# Altium project QUTMS_SteeringWheel.PrjPcb
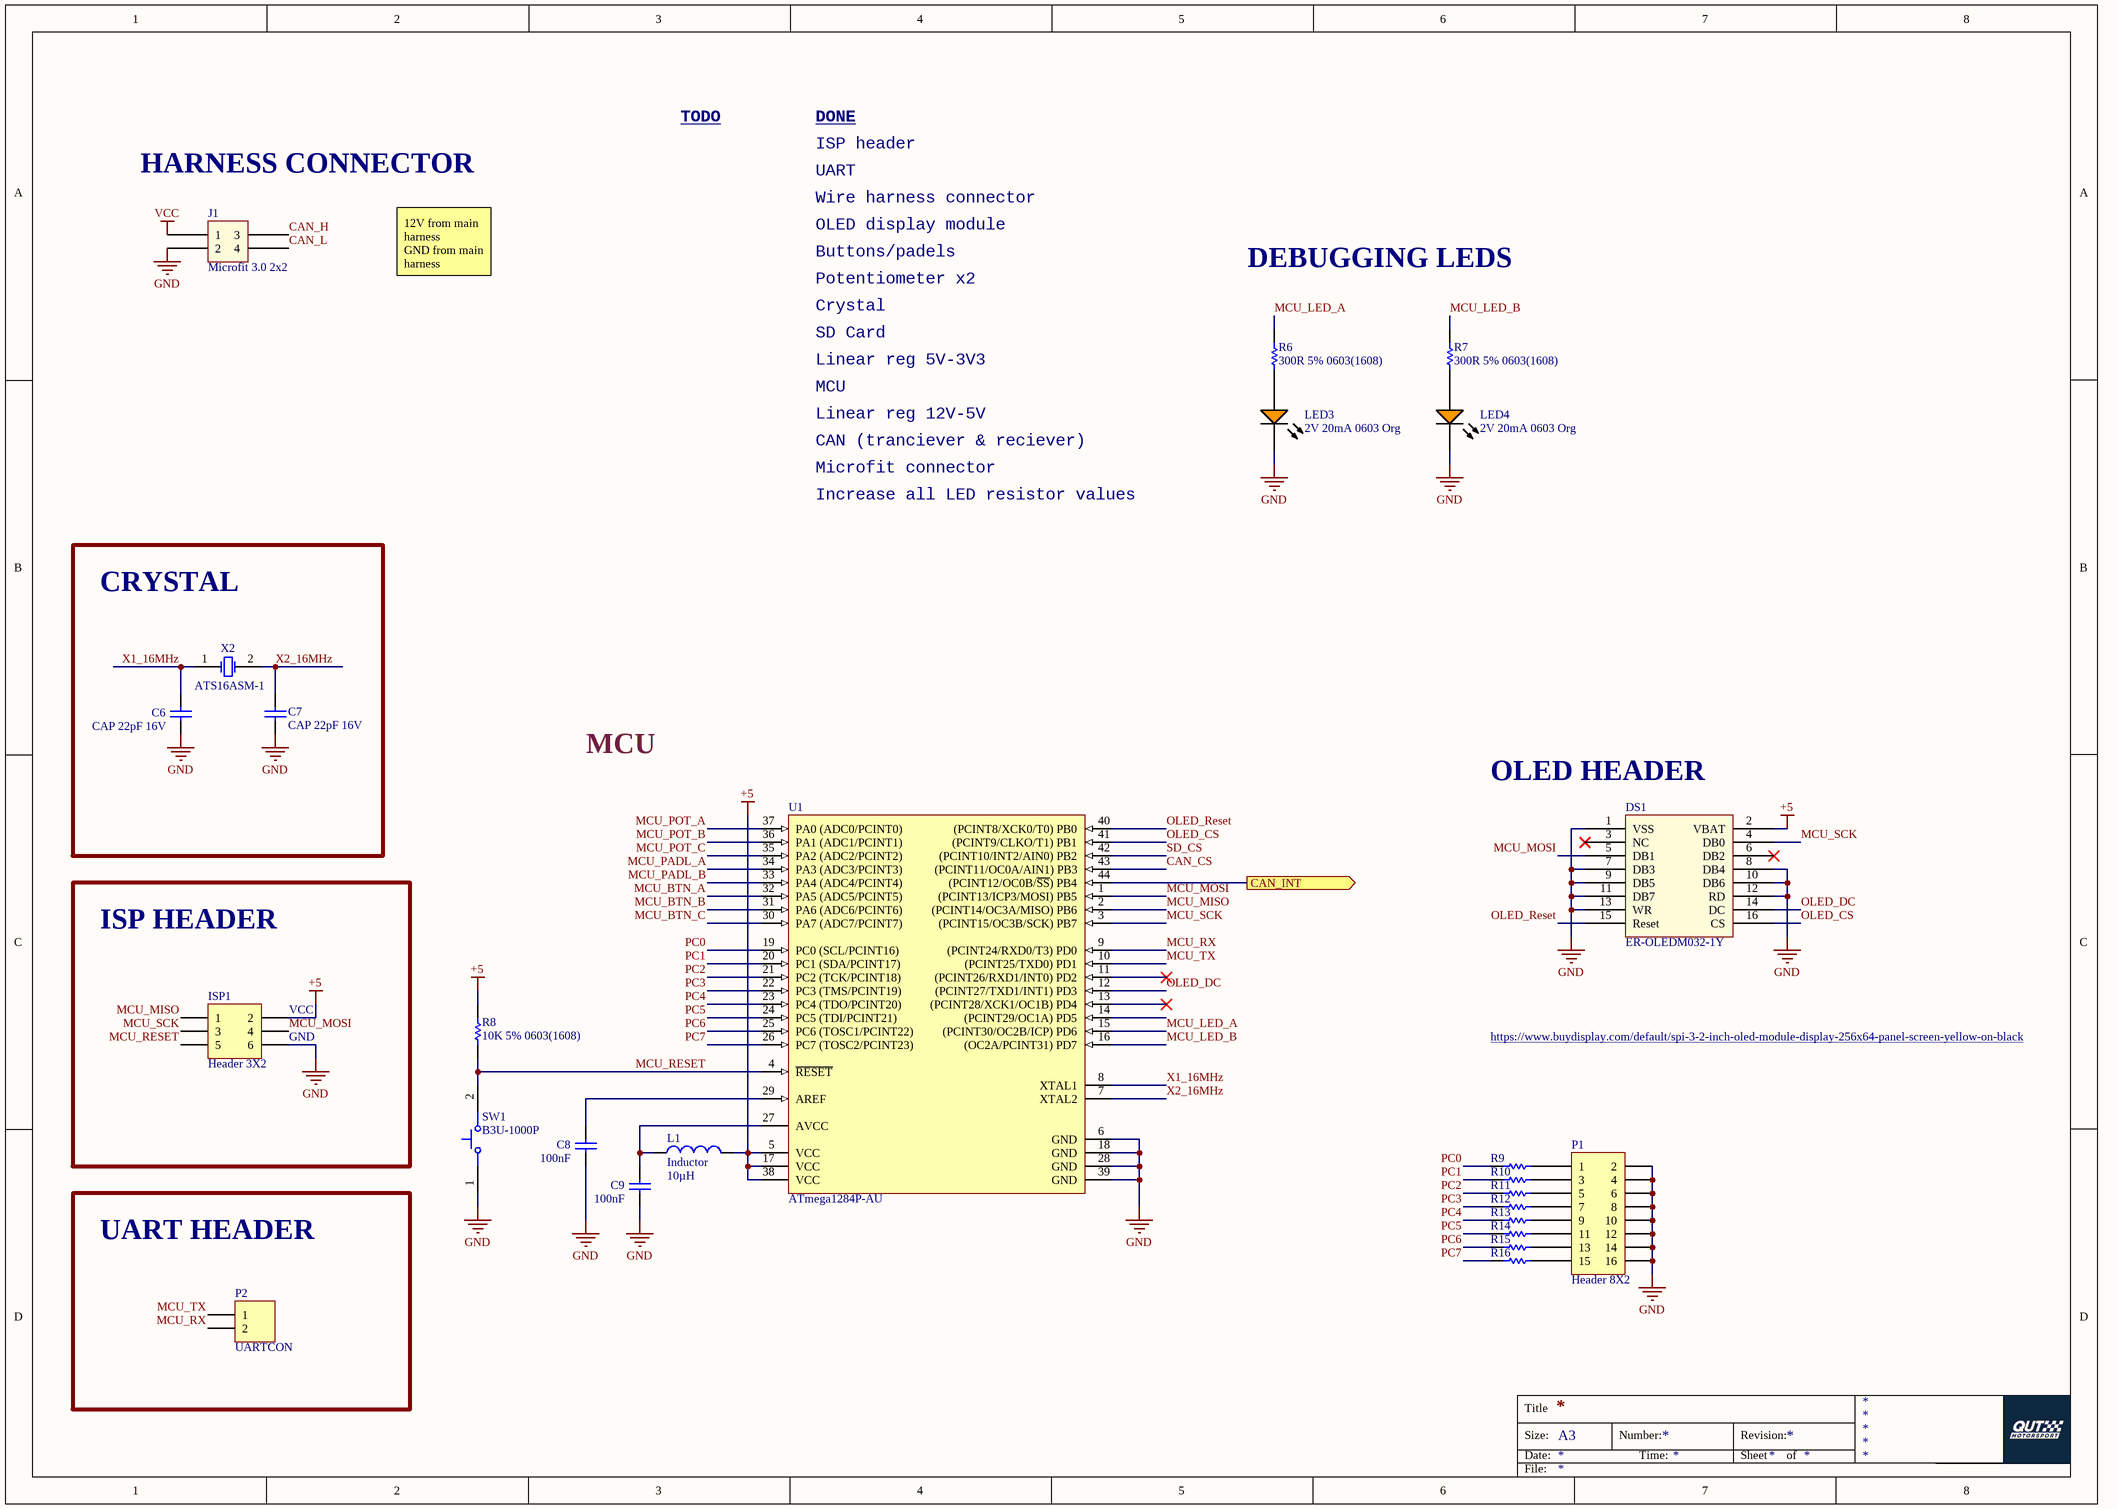
[diagram p0: Control.SchDoc]
5 sheets, 64 parts. Net scope: flat (ports and power ports of the same name join across sheets).
Board file: Board.PcbDoc
Sheets:
  Control.SchDoc
  CAN.SchDoc
  SDCard.SchDoc
  Linear Regulator.SchDoc
  Input.SchDoc

## Sheet Control.SchDoc
size A3

### Parts
C6  CAP 22pF 16V  [CAPC0603(1608)100_N]
C7  CAP 22pF 16V  [CAPC0603(1608)100_N]
C8  100nF  [CAPC0603(1608)100_M]
C9  100nF  [CAPC0603(1608)100_M]
DS1  ER-OLEDM032-1Y  [ER-OLEDM032-1Y]
ISP1  Header 3X2  [HDR2X3]
J1  Microfit 3.0 2x2  [Microfit_2X2_R_TH]
L1  Inductor  value 10µH  [0603]
LED3  2V 20mA 0603 Org  [KING-LED0603-25-ORANGE_V]
LED4  2V 20mA 0603 Org  [KING-LED0603-25-ORANGE_V]
P1  Header 8X2  [HDR2X8]
P2  UARTCON  [HDR1X2]
R6  300R 5% 0603(1608)  [RESC0603(1608)_N]
R7  300R 5% 0603(1608)  [RESC0603(1608)_N]
R8  10K 5% 0603(1608)  [RESC0603(1608)_N]
R9  JMP  [RESC0603(1608)_N]  (value not drawn)
R10  JMP  [RESC0603(1608)_N]  (value not drawn)
R11  JMP  [RESC0603(1608)_N]  (value not drawn)
R12  JMP  [RESC0603(1608)_N]  (value not drawn)
R13  JMP  [RESC0603(1608)_N]  (value not drawn)
R14  JMP  [RESC0603(1608)_N]  (value not drawn)
R15  JMP  [RESC0603(1608)_N]  (value not drawn)
R16  (no value)  [RESC0603(1608)_N]
SW1  B3U-1000P  [OMRON-B3U-1000_V]
U1  ATmega1284P-AU  [44A_N]
X2  ATS16ASM-1  [CTS-ATS-SM-XTAL-2]

### Blocks framed on the sheet
CRYSTAL: C6 C7 X2
ISP HEADER: ISP1
UART HEADER: P2

### Ports
CAN_INT (out)

### Nets
+5: DS1.2(VBAT) ISP1.2 L1.2 R8.2 U1.5(VCC) U1.17(VCC) U1.38(VCC)
GND: C6.1 C7.2 C8.1 C9.1 DS1.1(VSS) DS1.7(DB3) DS1.8(DB4) DS1.9(DB5) DS1.10(DB6) DS1.11(DB7) DS1.12(RD) DS1.13(WR) ISP1.6 J1.2 LED3.2(K) LED4.2(K) P1.2 P1.4 P1.6 P1.8 P1.10 P1.12 P1.14 P1.16 SW1.1 U1.6(GND) U1.18(GND) U1.28(GND) U1.39(GND)
VCC: J1.1
CAN_CS: U1.43((PCINT11/OC0A/AIN1)_PB3)
CAN_H: J1.3
CAN_L: J1.4
MCU_BTN_A: U1.32(PA5_(ADC5/PCINT5))
MCU_BTN_B: U1.31(PA6_(ADC6/PCINT6))
MCU_BTN_C: U1.30(PA7_(ADC7/PCINT7))
MCU_LED_A: R6.2 U1.15((PCINT30/OC2B/ICP)_PD6)
MCU_LED_B: R7.2 U1.16((OC2A/PCINT31)_PD7)
MCU_MISO: ISP1.1 U1.2((PCINT14/OC3A/MISO)_PB6)
MCU_MOSI: DS1.5(DB1) ISP1.4 U1.1((PCINT13/ICP3/MOSI)_PB5)
MCU_PADL_A: U1.34(PA3_(ADC3/PCINT3))
MCU_PADL_B: U1.33(PA4_(ADC4/PCINT4))
MCU_POT_A: U1.37(PA0_(ADC0/PCINT0))
MCU_POT_B: U1.36(PA1_(ADC1/PCINT1))
MCU_POT_C: U1.35(PA2_(ADC2/PCINT2))
MCU_RESET: ISP1.5 R8.1 SW1.2 U1.4(~{RESET})
MCU_RX: P2.2 U1.9((PCINT24/RXD0/T3)_PD0)
MCU_SCK: DS1.4(DB0) ISP1.3 U1.3((PCINT15/OC3B/SCK)_PB7)
MCU_TX: P2.1 U1.10((PCINT25/TXD0)_PD1)
OLED_CS: DS1.16(CS) U1.41((PCINT9/CLKO/T1)_PB1)
OLED_DC: DS1.14(DC) U1.12((PCINT27/TXD1/INT1)_PD3)
OLED_Reset: DS1.15(Reset) U1.40((PCINT8/XCK0/T0)_PB0)
PC0: R9.2 U1.19(PC0_(SCL/PCINT16))
PC1: R10.2 U1.20(PC1_(SDA/PCINT17))
PC2: R11.2 U1.21(PC2_(TCK/PCINT18))
PC3: R12.2 U1.22(PC3_(TMS/PCINT19))
PC4: R13.2 U1.23(PC4_(TDO/PCINT20))
PC5: R14.2 U1.24(PC5_(TDI/PCINT21))
PC6: R15.2 U1.25(PC6_(TOSC1/PCINT22))
PC7: R16.2 U1.26(PC7_(TOSC2/PCINT23))
SD_CS: U1.42((PCINT10/INT2/AIN0)_PB2)
X1_16MHz: C6.2 U1.8(XTAL1) X2.1(X1)
X2_16MHz: C7.1 U1.7(XTAL2) X2.2(X2)
NetC8_2: C8.2 U1.29(AREF)
NetC9_2: C9.2 L1.1 U1.27(AVCC)
NetLED3_1: LED3.1(A) R6.1
NetLED4_1: LED4.1(A) R7.1
NetP1_1: P1.1 R9.1
NetP1_3: P1.3 R10.1
NetP1_5: P1.5 R11.1
NetP1_7: P1.7 R12.1
NetP1_9: P1.9 R13.1
NetP1_11: P1.11 R14.1
NetP1_13: P1.13 R15.1
NetP1_15: P1.15 R16.1
NetU1_44: U1.44((PCINT12/OC0B/~{SS})_PB4) ; port CAN_INT

Not connected (* = marked no-connect by the designer): DS1 3(NC)* 6(DB2)*; U1 11((PCINT26/RXD1/INT0)_PD2)* 13((PCINT28/XCK1/OC1B)_PD4)* 14((PCINT29/OC1A)_PD5)

### Notes on the sheet
- HARNESS CONNECTOR
- TODO
- ISP header
- DONE
- UART
- OLED display module
- Wire harness connector
- 12V from main harness
  GND from main harness
- Potentiometer x2
- Buttons/padels
- Crystal
- DEBUGGING LEDS
- SD Card
- Linear reg 5V-3V3
- Linear reg 12V-5V
- CAN (tranciever & reciever)
- MCU
- Microfit connector
- Increase all LED resistor values
- (near DS1) OLED HEADER
- (near ISP1) VCC
- (near ISP1) GND
- https://www.buydisplay.com/default/spi-3-2-inch-oled-module-display-256x64-panel-screen-yellow-on-black
- Title
- Size:
- Date:
- A3
- Number:
- Time:
- Revision:
- Sheet
- of
- File:

### Library data of the parts
C6 C7 = CMP-1035-00808-1: CAP 22pF 16V ±5% 0603 (1608 Metric) Thickness 1mm SMD; Tolerance: Â±5%; Case-EIA: 0603; Case-Metric: 1608; Technology: SMT; Value: 22pF; Rated Voltage: 16 V; Max Thickness: 1 mm
C8 C9 = CMP-1035-02583-1: CAP 100nF 16V ±5% 0603 (1608 Metric) Thickness 1mm SMD; Tolerance: Â±5%; Case-Metric: 1608; Case-EIA: 0603; Rated Voltage: 16 V; Max Thickness: 1 mm; Technology: SMT; Value: 100nF
DS1 = ER-OLEDM032-1Y: SPI 3.2 inch OLED Module Display 256x64 Panel Screen,Yellow on Black; ComponentLink1Description: BuyDisplay; ComponentLink1URL: https://www.buydisplay.com/default/spi-3-2-inch-oled-module-display-256x64-panel-screen-yellow-on-black
ISP1 = Header 3X2: Header, 3-Pin, Dual row; LatestRevisionDate: 17-Jul-2002; LatestRevisionNote: Re-released for DXP Platform.; Publisher: Altium Limited
J1 = Microfit_2x2
L1 = Inductor: Code_IEC: 1005; Published: 8-Jun-2000; LatestRevisionDate: 29-May-2009; LatestRevisionNote: IPC-7351 Footprint Added.; PackageReference: 0402-A; Publisher: Altium Limited; PackageDescription: Chip Inductor; Code_JEITA: 0402
LED3 LED4 = CMP-0239-00002-1: LED, SMT, 0603(1608), 0.25mm Tthickness, Super Bright Orange; PartNumber: APG1608SEKC/T; Forward Current: 30 mA; Power Dissipation: 75 mW; Reverse Voltage: 5 V; Packing: Reel; PackageDescription: 2-Pin SMT LED, 1.6 x 0.8 mm Body, 0.25mm Thickness; ComponentLink1URL: http://www.kingbrightusa.com/; PackageVersion: Rev. 4A, 12/2011; Storage Temperature: -40 to 85 degC; Mounting Technology: Surface Mount; ComponentLink2Description: Datasheet; DatasheetVersion: Rev. 4A, 12/2011; ComponentLink2URL: http://www.kingbrightusa.com/images/catalog/SPEC/APG1608SEKC-T.pdf; PackageReference: LED0603-25-ORANGE; ComponentLink1Description: Manufacturer URL
P1 = Header 8X2: Header, 8-Pin, Dual row; LatestRevisionDate: 17-Jul-2002; LatestRevisionNote: Re-released for DXP Platform.; Publisher: Altium Limited
P2 = Header 2: Header, 2-Pin; LatestRevisionDate: 17-Jul-2002; LatestRevisionNote: Re-released for DXP Platform.; Publisher: Altium Limited
R6 R7 R9-R16 = CMP-1012-00061-1: 300R 0.1W 5% 0603 (1608 Metric)  SMD; Case-EIA: 0603; Value: 300.00 Ohm; Case-Metric: 1608; Tolerance: 5 %; Power: 0.1 W; Technology: SMT
R8 = CMP-1012-00098-1: 10K 0.1W 5% 0603 (1608 Metric)  SMD; Case-EIA: 0603; Value: 10000.00 Ohm; Case-Metric: 1608; Technology: SMT; Tolerance: 5 %; Power: 0.1 W
SW1 = CMP-2100-03586-1: Ultra-Small Tactile Switch, 0.05 A, 12 V, -25 to 70 degC, 2-Pin SMD, RoHS, Tape and Reel; Manufacturer: Omron Electronic Components; Operating Force: 1.5N; Current Rating: 50mA; Voltage Rating (DC): 12V; Electrical Life: 200000Cycles; Actuator Length: 0.4mm; Insulation Resistance: 100MOhm; Switch Travel: 0.15mm; Throw Configuration: SPST; Illumination Type: Illuminated; Width: 3mm; Weight: 0.022g; Datasheet Version: 42005.0; Datasheet URL: http://www.omron.com/ecb/products/pdf/en-b3u.pdf; Height: 1.2mm; Package Quantity: 1; REACH SVHC: Unknown; Contact Current Rating: 50mA; Contact Material: Silver; Max Current Rating: 50mA; Package Reference: B3U-1000; Termination: SMD/SMT; Packaging: TapeandReel; Manufacturer URL: http://www.omron.com/; RoHSCompliant: true; Mount: SurfaceMount; Length: 4mm; Min Operating Temperature: -25degC; Depth: 2.5mm; Lead Free: LeadFree; Case/Package: SMD/SMT; Package Description: 2-Pin Surface Mount Device, Body 3 x 2.5 mm; Max Operating Temperature: 70degC; Orientation: Straight
U1 = CMP-0107-00053-1: 20 MHz 8-bit AVR Microcontroller with 128KB Flash, 44-Pin TQFP Pkg, Industrial Temp; PackageVersion: rev.B, Oct-2001; PackageReference: 44A; DatasheetVersion: revD, Nov-2009; PackageDescription: 44-Pin Plastic Thin Profile Quad Flat Pack, 10 x 10 x 1.0 mm Body, 0.8 mm Pitch (TQFP)
X2 = CMP-0585-00002-2: ATS-SM Series Quartz Crystal, 16 MHz, -20 to 70 degC, 11.1 x 4.83 x 4.3mm SMD, RoHS, Tape and Reel; Manufacturer: CTS Corporation; Shunt Capacitance (C0): 7.0 pF Max; Frequency: 16 MHz; Oscillation Mode: Fundamental or 3rd Overtone; Crystal Cut: AT-Cut; ESR Maximum: 40 Ohms; Drive Level (Type): 100 uW; PackageDescription: 2-Pin SMD, Body 11.1 x 4.83 mm, Pitch 8.5 mm; PackageReference: ATS-SM-XTAL-2; ComponentLink1URL: http://www.ctscorp.com/; PartNumber: ATS16ASM-1; RoHS: TRUE; ComponentLink1Description: Manufacturer URL; Operating Temperature: -20 to 70 degC; DatasheetVersion: Rev. K; ComponentLink2Description: Datasheet; Packing: Tape and Reel; ComponentLink2URL: http://www.ctscorp.com/components/Datasheets/008-0309-0.pdf; Mounting Technology: Surface Mount; ComponentLink3URL: http://www.ctscorp.com/components/Datasheets/008-0309-0.pdf; ComponentLink3Description: Package Specification

## Sheet CAN.SchDoc
size A4
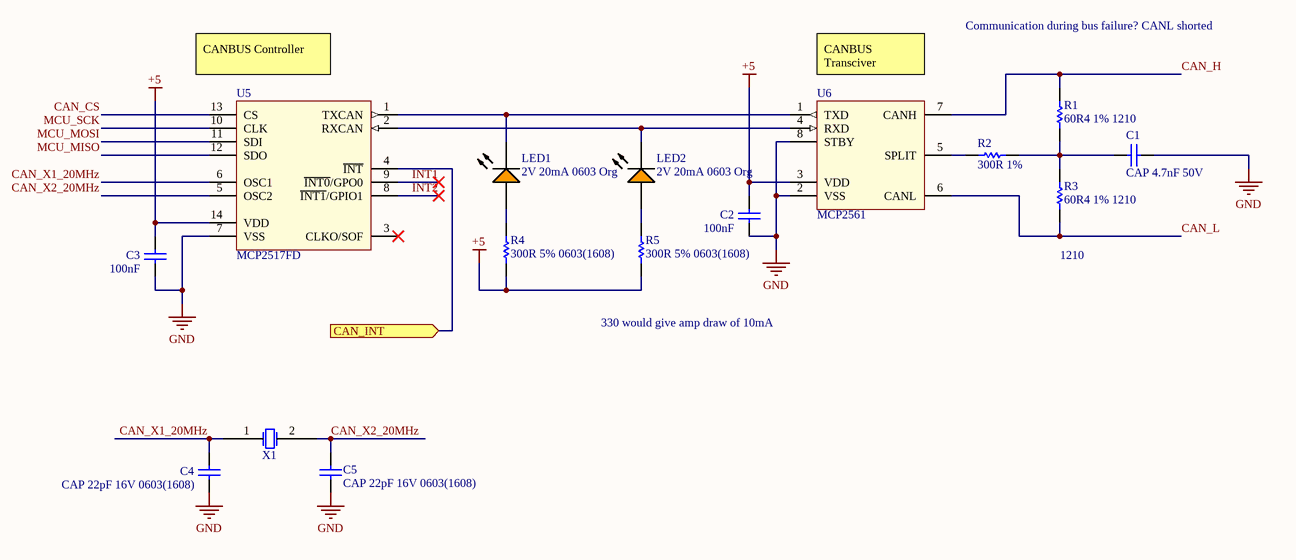
[diagram p1: CAN.SchDoc]

### Parts
C1  CAP 4.7nF 50V  [CAPC0603(1608)100_L]
C2  100nF  [CAPC0603(1608)100_M]
C3  100nF  [CAPC0603(1608)100_M]
C4  CAP 22pF 16V 0603(1608)  [CAPC0603(1608)100_N]
C5  CAP 22pF 16V 0603(1608)  [CAPC0603(1608)100_N]
LED1  2V 20mA 0603 Org  [KING-LED0603-25-ORANGE_V]
LED2  2V 20mA 0603 Org  [KING-LED0603-25-ORANGE_V]
R1  60R4 1% 1210  [RESC1210(3225)_L]
R2  300R 1%  [RESC0603(1608)_M]
R3  60R4 1% 1210  [RESC1210(3225)_L]
R4  300R 5% 0603(1608)  [RESC0603(1608)_N]
R5  300R 5% 0603(1608)  [RESC0603(1608)_N]
U5  MCP2517FD  [MCP2517FD SOIC]
U6  MCP2561  [MCP2561 SOIC]
X1  Crystal 20MHz  [Crystal 20MHz]  (value not drawn)

### Ports
CAN_INT (in)

### Nets
+5: C2.2 C3.2 R4.1 R5.1 U5.14(VDD) U6.3(VDD)
GND: C1.2 C2.1 C3.1 C4.1 C5.2 U5.7(VSS) U6.2(VSS) U6.8(STBY)
CAN_CS: U5.13(CS)
CAN_H: R1.2 U6.7(CANH)
CAN_L: R3.1 U6.6(CANL)
CAN_X1_20MHz: C4.2 U5.6(OSC1) X1.1
CAN_X2_20MHz: C5.1 U5.5(OSC2) X1.2
INT1: U5.9(~{INT0}/GPO0)
INT2: U5.8(~{INT1}/GPIO1)
MCU_MISO: U5.12(SDO)
MCU_MOSI: U5.11(SDI)
MCU_SCK: U5.10(CLK)
NetC1_1: C1.1 R1.1 R2.2 R3.2
NetLED1_1: LED1.1(A) R4.2
NetLED1_2: LED1.2(K) U5.1(TXCAN) U6.1(TXD)
NetLED2_1: LED2.1(A) R5.2
NetLED2_2: LED2.2(K) U5.2(RXCAN) U6.4(RXD)
NetR2_1: R2.1 U6.5(SPLIT)
NetU1_44: U5.4(~{INT}) ; port CAN_INT

Not connected (* = marked no-connect by the designer): U5 3(CLKO/SOF)*

### Notes on the sheet
- (near U5) CANBUS Controller
- (near U6) CANBUS Transciver
- Communication during bus failure? CANL shorted
- (near R3) 1210
- 330 would give amp draw of 10mA
- Title
- Size:
- Date:
- A4
- Number:
- Time:
- Revision:
- Sheet
- of
- File:

### Library data of the parts
C1 = CMP-1035-02200-1: CAP 4.7nF 50V ±1% 0603 (1608 Metric) Thickness 1mm SMD; Tolerance: Â±1%; Case-Metric: 1608; Case-EIA: 0603; Max Thickness: 1 mm; Value: 4.7nF; Technology: SMT; Rated Voltage: 50 V
C2 C3 = CMP-1035-02583-1: as C8 on sheet Control; Rated Voltage: 16 V; Max Thickness: 1 mm; Technology: SMT; Value: 100nF
C4 C5 = CMP-1035-00808-1: as C6 on sheet Control; Technology: SMT; Value: 22pF; Rated Voltage: 16 V; Max Thickness: 1 mm
LED1 LED2 = CMP-0239-00002-1: as LED3 on sheet Control; PackageDescription: 2-Pin SMT LED, 1.6 x 0.8 mm Body, 0.25mm Thickness; ComponentLink1URL: http://www.kingbrightusa.com/; PackageVersion: Rev. 4A, 12/2011; Storage Temperature: -40 to 85 degC; Mounting Technology: Surface Mount; ComponentLink2Description: Datasheet; DatasheetVersion: Rev. 4A, 12/2011; ComponentLink2URL: http://www.kingbrightusa.com/images/catalog/SPEC/APG1608SEKC-T.pdf; PackageReference: LED0603-25-ORANGE; ComponentLink1Description: Manufacturer URL
R1 R3 = CMP-1015-00372-1: 60R4 0.5W 1% 1210 (3225 Metric)  SMD; Case-Metric: 3225; Case-EIA: 1210; Value: 60.40 Ohm; Technology: SMT; Tolerance: 1 %; Power: 0.5 W
R2 = CMP-1012-00449-1: 300R 0.1W 1% 0603 (1608 Metric)  SMD; Value: 300.00 Ohm; Case-EIA: 0603; Case-Metric: 1608; Technology: SMT; Power: 0.1 W; Tolerance: 1 %
R4 R5 = CMP-1012-00061-1: as R6 on sheet Control; Tolerance: 5 %; Power: 0.1 W; Technology: SMT
X1 = Crystal 20MHz: ComponentLink1Description: Datasheet; ComponentLink1URL: http://cfd.citizen.co.jp/english/prod-tech/product/pdf/datasheet_AT/HCM49_E.pdf

## Sheet SDCard.SchDoc: SD Card Schematic
size A4; Author: Zoe Goodward
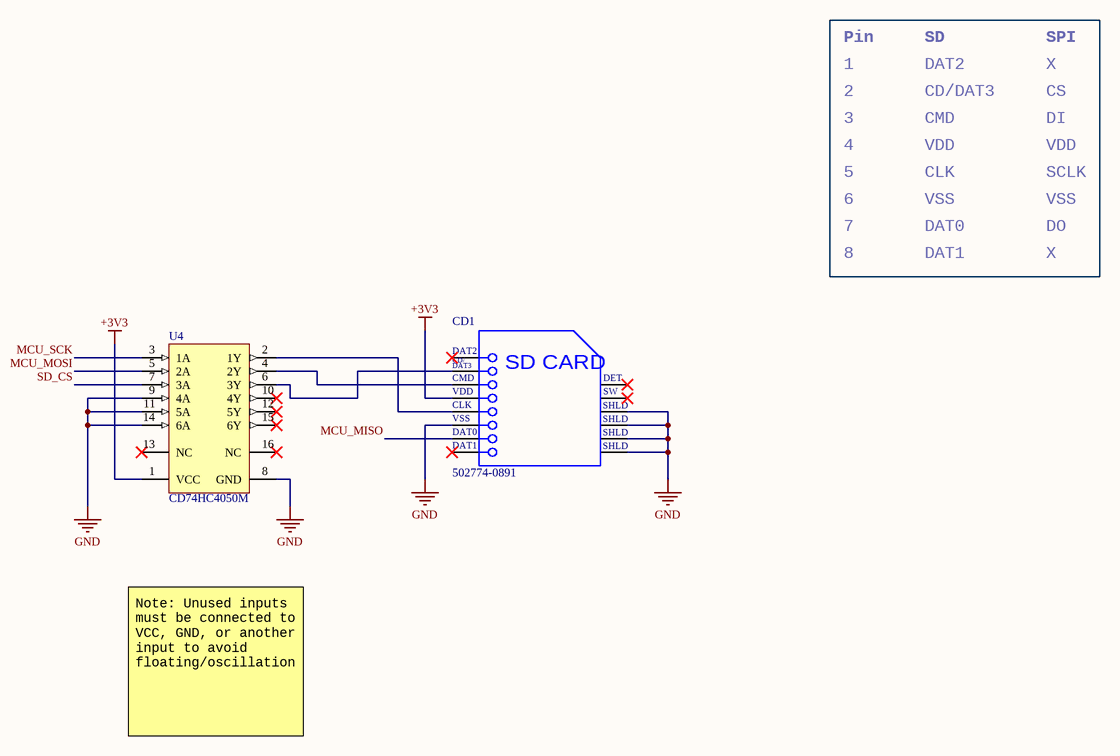
[diagram p2: SDCard.SchDoc]

### Parts
CD1  502774-0891  [MOLX-502774-0891_V]
U4  CD74HC4050M  [D0016A_N]

### Nets
+3V3: CD1.4(VDD) U4.1(VCC)
GND: CD1.6(VSS) CD1.11(SHLD) CD1.12(SHLD) CD1.13(SHLD) CD1.14(SHLD) U4.8(GND) U4.9(4A) U4.11(5A) U4.14(6A)
MCU_MISO: CD1.7(DAT0)
MCU_MOSI: U4.5(2A)
MCU_SCK: U4.3(1A)
SD_CS: U4.7(3A)
NetCD1_2: CD1.2(CD/DAT3) U4.6(3Y)
NetCD1_3: CD1.3(CMD) U4.4(2Y)
NetCD1_5: CD1.5(CLK) U4.2(1Y)

Not connected (* = marked no-connect by the designer): CD1 1(DAT2)* 8(DAT1)* 9(DETECT)* 10(SWITCH)*; U4 10(4Y)* 12(5Y)* 13(NC)* 15(6Y)* 16(NC)*

### Notes on the sheet
- Pin
- SD
- SPI
- 1
- 2
- DAT2
- CD/DAT3
- X
- CS
- 3
- 4
- 5
- CMD
- VDD
- CLK
- DI
- SCLK
- 6
- 7
- VSS
- DAT0
- DO
- 8
- DAT1
- Note: Unused inputs must be connected to VCC, GND, or another input to avoid floating/oscillation
- Title
- Size:
- Date:
- A4
- Number:
- Time:
- Revision:
- Sheet
- of
- File:
- (in symbol CMP-2000-05248-1) CD/; DAT3; SD CARD; DET; SW

### Library data of the parts
CD1 = CMP-2000-05248-1: Micro SD Memory Card Connector, 0.5 A, 10 V (DC), -25 to 85 degC, 8-Pin SMT, RoHS, Tape and Reel; Manufacturer: Molex; 3D Model: 502774-0891.stp; Online Catalog: microSD™Series; Number of Positions: 10(8+2); Card Type: SecureDigital-microSD™; Insertion, Removal Method: PushIn,PushOut; Other Names: WM24066DKR; Connector Type: ConnectorandEjector; Features: Switch; Family: MemoryConnectors-PCCardSockets; Manufacturer URL: http://www.molex.com/; Mounting Type: SurfaceMount,RightAngle; Contact Finish Thickness: 20µin(0.51µm); Standard Package: 1; Series: 502774; Ejector Side: -; Datasheet Version: Rev. D, 04/2004; Category: Connectors,Interconnects; Contact Finish: Gold; Datasheet URL: https://datasheet.ciiva.com/1104/1499551-1104671.pdf; RoHS Information: 502774-0891CertofCompliance; Mounting Feature: Reverse-Bottom; Packaging: Digi-Reel; Height Above Board: 0.071"(1.80mm); Catalog Drawings: 502774-0891
U4 = CMP-0440-00356-3: High Speed CMOS Logic Hex Non-Inverting Buffers, D0016A, TUBE; Manufacturer: Texas Instruments; F @ Nom Voltage(Max)(Mhz): 28; Voltage(Nom)(V): 6; VCC(Min)(V): 2; tpd @ Nom Voltage(Max)(ns): 18; ICC @ Nom Voltage(Max)(mA): 0.02; Rating: Catalog; PackageReference: D0016A; DatasheetVersion: SCHS205I; Output Type: CMOS; Operating Temperature Range(C): -55 to 125; Bits(#): 6; VCC(Max)(V): 6; PackageVersion: http://www.ti.com/lit/ml/mpds178g/mpds178g.pdf; Input Type: CMOS; Generic Part Number: CD74HC4050; Code_JEDEC: MS-012 variation AC

## Sheet Linear Regulator.SchDoc: Linear Regulator
size A4
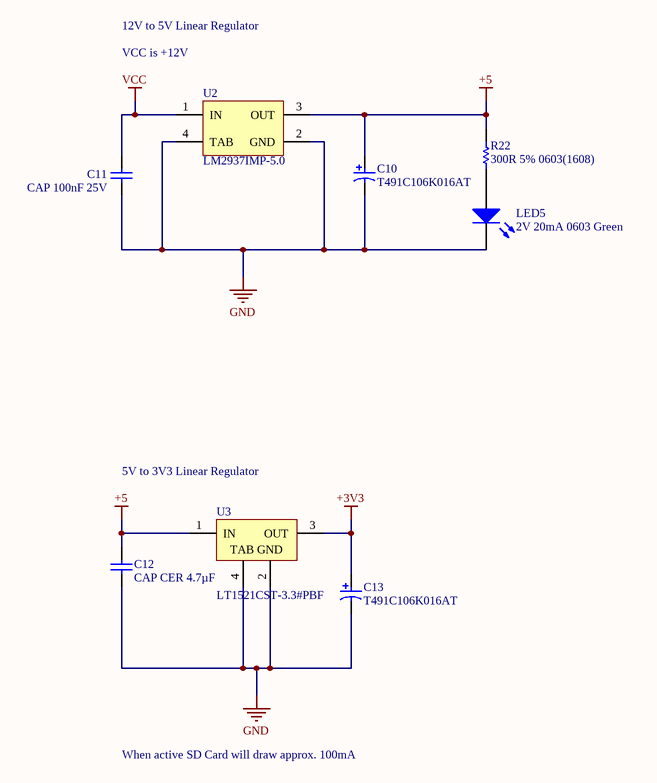
[diagram p3: Linear Regulator.SchDoc]

### Parts
C10  T491C106K016AT  [KEMT-T491-C_L]
C11  CAP 100nF 25V  [CAPC0603(1608)100_M]
C12  CAP CER 4.7µF  [CAPC1608X90X35NL10T15]
C13  T491C106K016AT  [KEMT-T491-C_L]
LED5  2V 20mA 0603 Green  [LITE-ON-LTST-C191KRKT-2_V]
R22  300R 5% 0603(1608)  [RESC0603(1608)_N]
U2  LM2937IMP-5.0  [DCY0004A_N]
U3  LT1521CST-3.3#PBF  [LT-ST-3-SOT-223_N]

### Nets
+3V3: C13.1 U3.3(OUT)
+5: C10.1 C12.2 R22.2 U2.3(OUT) U3.1(IN)
GND: C10.2 C11.1 C12.1 C13.2 LED5.2(K) U2.2(GND) U2.4(TAB) U3.2(GND) U3.4(TAB)
VCC: C11.2 U2.1(IN)
NetLED5_1: LED5.1(A) R22.1

### Notes on the sheet
- 12V to 5V Linear Regulator
- VCC is +12V
- 5V to 3V3 Linear Regulator
- When active SD Card will draw approx. 100mA
- Title
- Size:
- Date:
- A4
- Number:
- Time:
- Revision:
- Sheet
- of
- File:

### Library data of the parts
C10 C13 = CMP-2000-07197-1: Tantalum Capacitor, 10 uF, +/- 10%, 16 V, -55 to 125 degC, 2-Pin SMD (T491-C), RoHS, Tape and Reel; Manufacturer: Kemet; Product Diameter (mm): NotRequiredmm; Product Depth (mm): 3.2mm; ESR: 1.8ohm; Product Length (mm): 6mm; DCL: 1.6uA; Seal: NotRequired; Voltage: 16VDC; DF: 6%; Product Height (mm): 2.5mm; Polarity: Polar; Rad Hardened: No; Case Style: Molded; Capacitance: 10000000pF; Datasheet URL: http://capacitoredge.kemet.com/capedge2/DataSheet/Datasheet-T491C106K016AT.pdf?pn=T491C106K016AT; Datasheet Version: 10/2016; Packaging: TapeandReel; Tolerance (+ or -): 10%; Mounting Technology: SurfaceMount; Package Description: 2-Pin Surface Mount Device, Body 6 x 3.2 mm; Manufacturer URL: http://www.kemet.com/; Length W/Weld (max): NotRequiredmm; Lead Spacing (nom): NotRequiredmm; Operating Temp Range: -55Cto125C; Package Reference: T491-C; Mounting Style: SurfaceMount; Length W/Weld: NotRequiredmm; Failure Rate: NotRequired; Wire Form: NotRequired; Package / Case: 6032-28; Insulation: NotRequired; Construction: SMTChip; Seated Plane Height: NotRequiredmm; Case Code: C
C11 = CMP-1035-02588-1: CAP 100nF 25V ±10% 0603 (1608 Metric) Thickness 1mm SMD; Case-Metric: 1608; Case-EIA: 0603; Tolerance: Â±10%; Max Thickness: 1 mm; Technology: SMT; Rated Voltage: 25 V; Value: 100nF
C12 = CMP-2006-02523-1: GRM188R61E475KE11D; Manufacturer: Murata; Part Number: GRM188R61E475KE11D
LED5 = CMP-2000-05198-1: Chip LED, Green, 574 nm, 40 pF, -55 to 85 degC, 2-Pin SMD, RoHS, Tape and Reel; Manufacturer: Lite-On; Rad Hardened: No; Emitting Color: YellowGreen; Product Height (mm): 0.55mm; Forward Voltage: 2.4V; Number of Elements: 1; Dominant Wave Length: 571nm; DELETED: Compliant; Viewing Angle: 130deg; High Brightness: Yes; Peak Wavelength: 574nm; Type: Uni-Color; Forward Current: 30mA; Product Length (mm): 1.6mm; Luminous Intensity: 35mcd; Chip Material: AlGaInP; Product Depth (mm): 0.8mm; Shape Type: Rectangular; Reverse Voltage: 5V; Power Dissipation: 75W; Pin Count: 2; Lens Dimensions: 1.1X0.8X0.37mm; Packaging: TapeandReel; Main Category: ChipLED; Operating Temperature Classification: Industrial; Package Type: ChipLed; Test Current (It): 20mA; Mounting: SurfaceMount; Lum Intensity: 35mcd; Operating Temp Range: -55Cto85C; Datasheet Version: Jan-07; Datasheet URL: http://download.siliconexpert.com/pdfs/2007/08/26/semi_b/manual/lot/ds/ltst-c191kgkt.pdf; Manufacturer URL: http://www.us.liteon.com/
R22 = CMP-1012-00061-1: as R6 on sheet Control; Tolerance: 5 %; Power: 0.1 W; Technology: SMT
U2 = CMP-0062-01759-3: 500 mA Low Dropout Regulator, 4-pin SOT-223; Manufacturer: Texas Instruments; PowerWise: N; PackageTopMarking: XYTT*L71B; CompType: LDO IC; Code_JEDEC: TO-261-AA; PinCount: 4; ComponentLink1URL: http://www.ti.com/general/docs/lit/getliterature.tsp?genericPartNumber=LM2937&fileType=pdf; RoHS: N; Code_IPC: SOT223-4; ComponentLink1Description: Datasheet URL; PackageReference: DCY0004A; PackageDescription: Molded SOT-223, 6.50 x 3.56 x 1.6mm Body, 4 Lead, 2.3mm Pitch
U3 = CMP-0476-01842-1: 300 mA Low Dropout Regulator with Micropower Quiescent Current and Shutdown, 4.3 to 20 V Vin, 3.3 V Vout, 3-pin SOT223 (ST-3), 0 to 125 degC, Pb-Free; Manufacturer: Linear Technology; Shutdown Current(uA): 6; Vin Max(V): 20; Output Voltage: 3.3 V; Dropout Voltage(V): 0.5; Discrete Pass Element: no; Number of Outputs: 1; Isupply(mA): 0.012; Iout(mA): 300; Vin Min(V): 4.3; PartNumber: LT1521CST-3.3#PBF; ComponentLink1Description: Manufacturer URL; ComponentLink1URL: http://www.linear.com/; RoHS: TRUE; PackageReference: ST-3; PackageDescription: 3-Pin Plastic SOT-223, 3.505 x 6.505 mm Body, Pitch 2.3 mm; ComponentLink3Description: Package Specification; PackageVersion: Jun-10; Mounting Technology: Surface Mount; ComponentLink2Description: Datasheet; ComponentLink3URL: http://cds.linear.com/docs/en/packaging/SOT_3_05-08-1630.pdf; DatasheetVersion: Rev. B; ComponentLink2URL: http://cds.linear.com/docs/en/datasheet/1521335fb.pdf

## Sheet Input.SchDoc
size A4
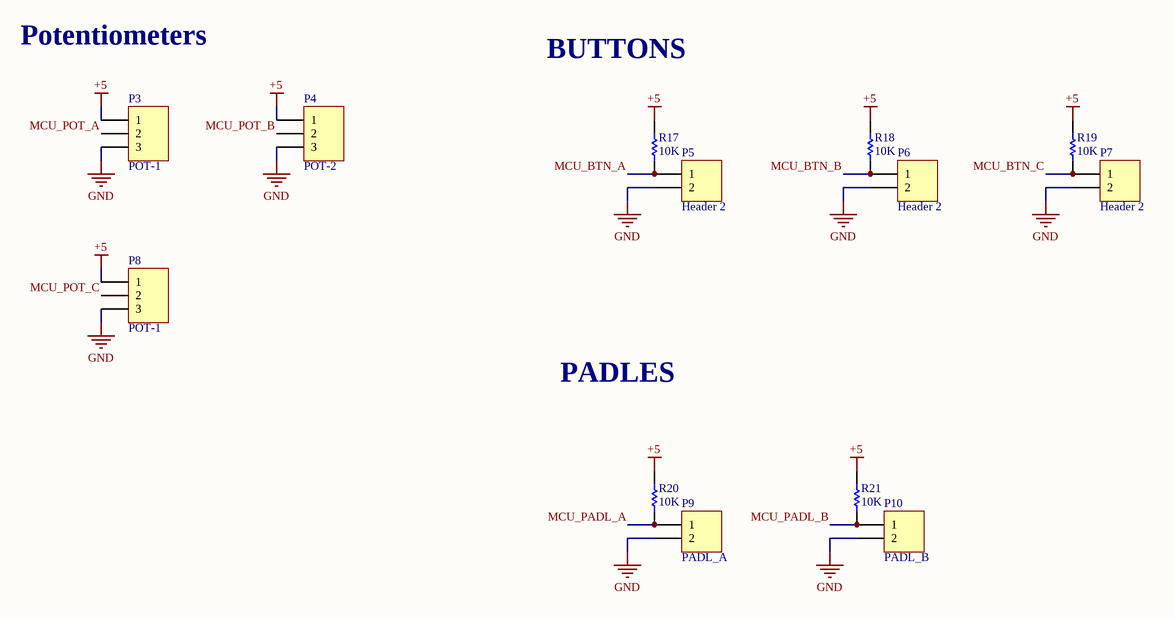
[diagram p4: Input.SchDoc]

### Parts
P3  POT-1  [HDR1X3]
P4  POT-2  [HDR1X3]
P5  Header 2  [HDR1X2]
P6  Header 2  [HDR1X2]
P7  Header 2  [HDR1X2]
P8  POT-1  [HDR1X3]
P9  PADL_A  [HDR1X2]
P10  PADL_B  [HDR1X2]
R17  10K  [RESC0603(1608)_N]
R18  10K  [RESC0603(1608)_N]
R19  10K  [RESC0603(1608)_N]
R20  10K  [RESC0603(1608)_N]
R21  10K  [RESC0603(1608)_N]

### Nets
+5: P3.1 P4.1 P8.1 R17.1 R18.1 R19.1 R20.1 R21.1
GND: P3.3 P4.3 P5.2 P6.2 P7.2 P8.3 P9.2 P10.2
MCU_BTN_A: P5.1 R17.2
MCU_BTN_B: P6.1 R18.2
MCU_BTN_C: P7.1 R19.2
MCU_PADL_A: P9.1 R20.2
MCU_PADL_B: P10.1 R21.2
MCU_POT_A: P3.2
MCU_POT_B: P4.2
MCU_POT_C: P8.2

### Notes on the sheet
- Potentiometers
- BUTTONS
- PADLES
- Title
- Size:
- Date:
- A4
- Number:
- Time:
- Revision:
- Sheet
- of
- File:

### Library data of the parts
P3 P4 P8 = Header 3: Header, 3-Pin; LatestRevisionDate: 17-Jul-2002; LatestRevisionNote: Re-released for DXP Platform.; Publisher: Altium Limited
P5-P7 P9 P10 = Header 2: Header, 2-Pin; LatestRevisionDate: 17-Jul-2002; LatestRevisionNote: Re-released for DXP Platform.; Publisher: Altium Limited
R17-R21 = CMP-1012-00098-1: as R8 on sheet Control; Technology: SMT; Tolerance: 5 %; Power: 0.1 W

## Nets that join several sheets
+3V3: SDCard (CD1.4 U4.1), Linear Regulator (C13.1 U3.3)
+5: Control (7 pins), CAN (6 pins), Linear Regulator (5 pins), Input (8 pins)
GND: Control (29 pins), CAN (8 pins), SDCard (9 pins), Linear Regulator (9 pins), Input (8 pins)
VCC: Control (J1.1), Linear Regulator (C11.2 U2.1)
NetU1_44: Control (U1.44), CAN (U5.4)